# Altium schematic sheet sepic12-12.SchDoc
size A3; Organization: Yandex; Address2: 11 Timura Frunze st., building 2; Release_Date: yyyy-mm-dd; Language: en; Organization2: Self Driving Group LLC
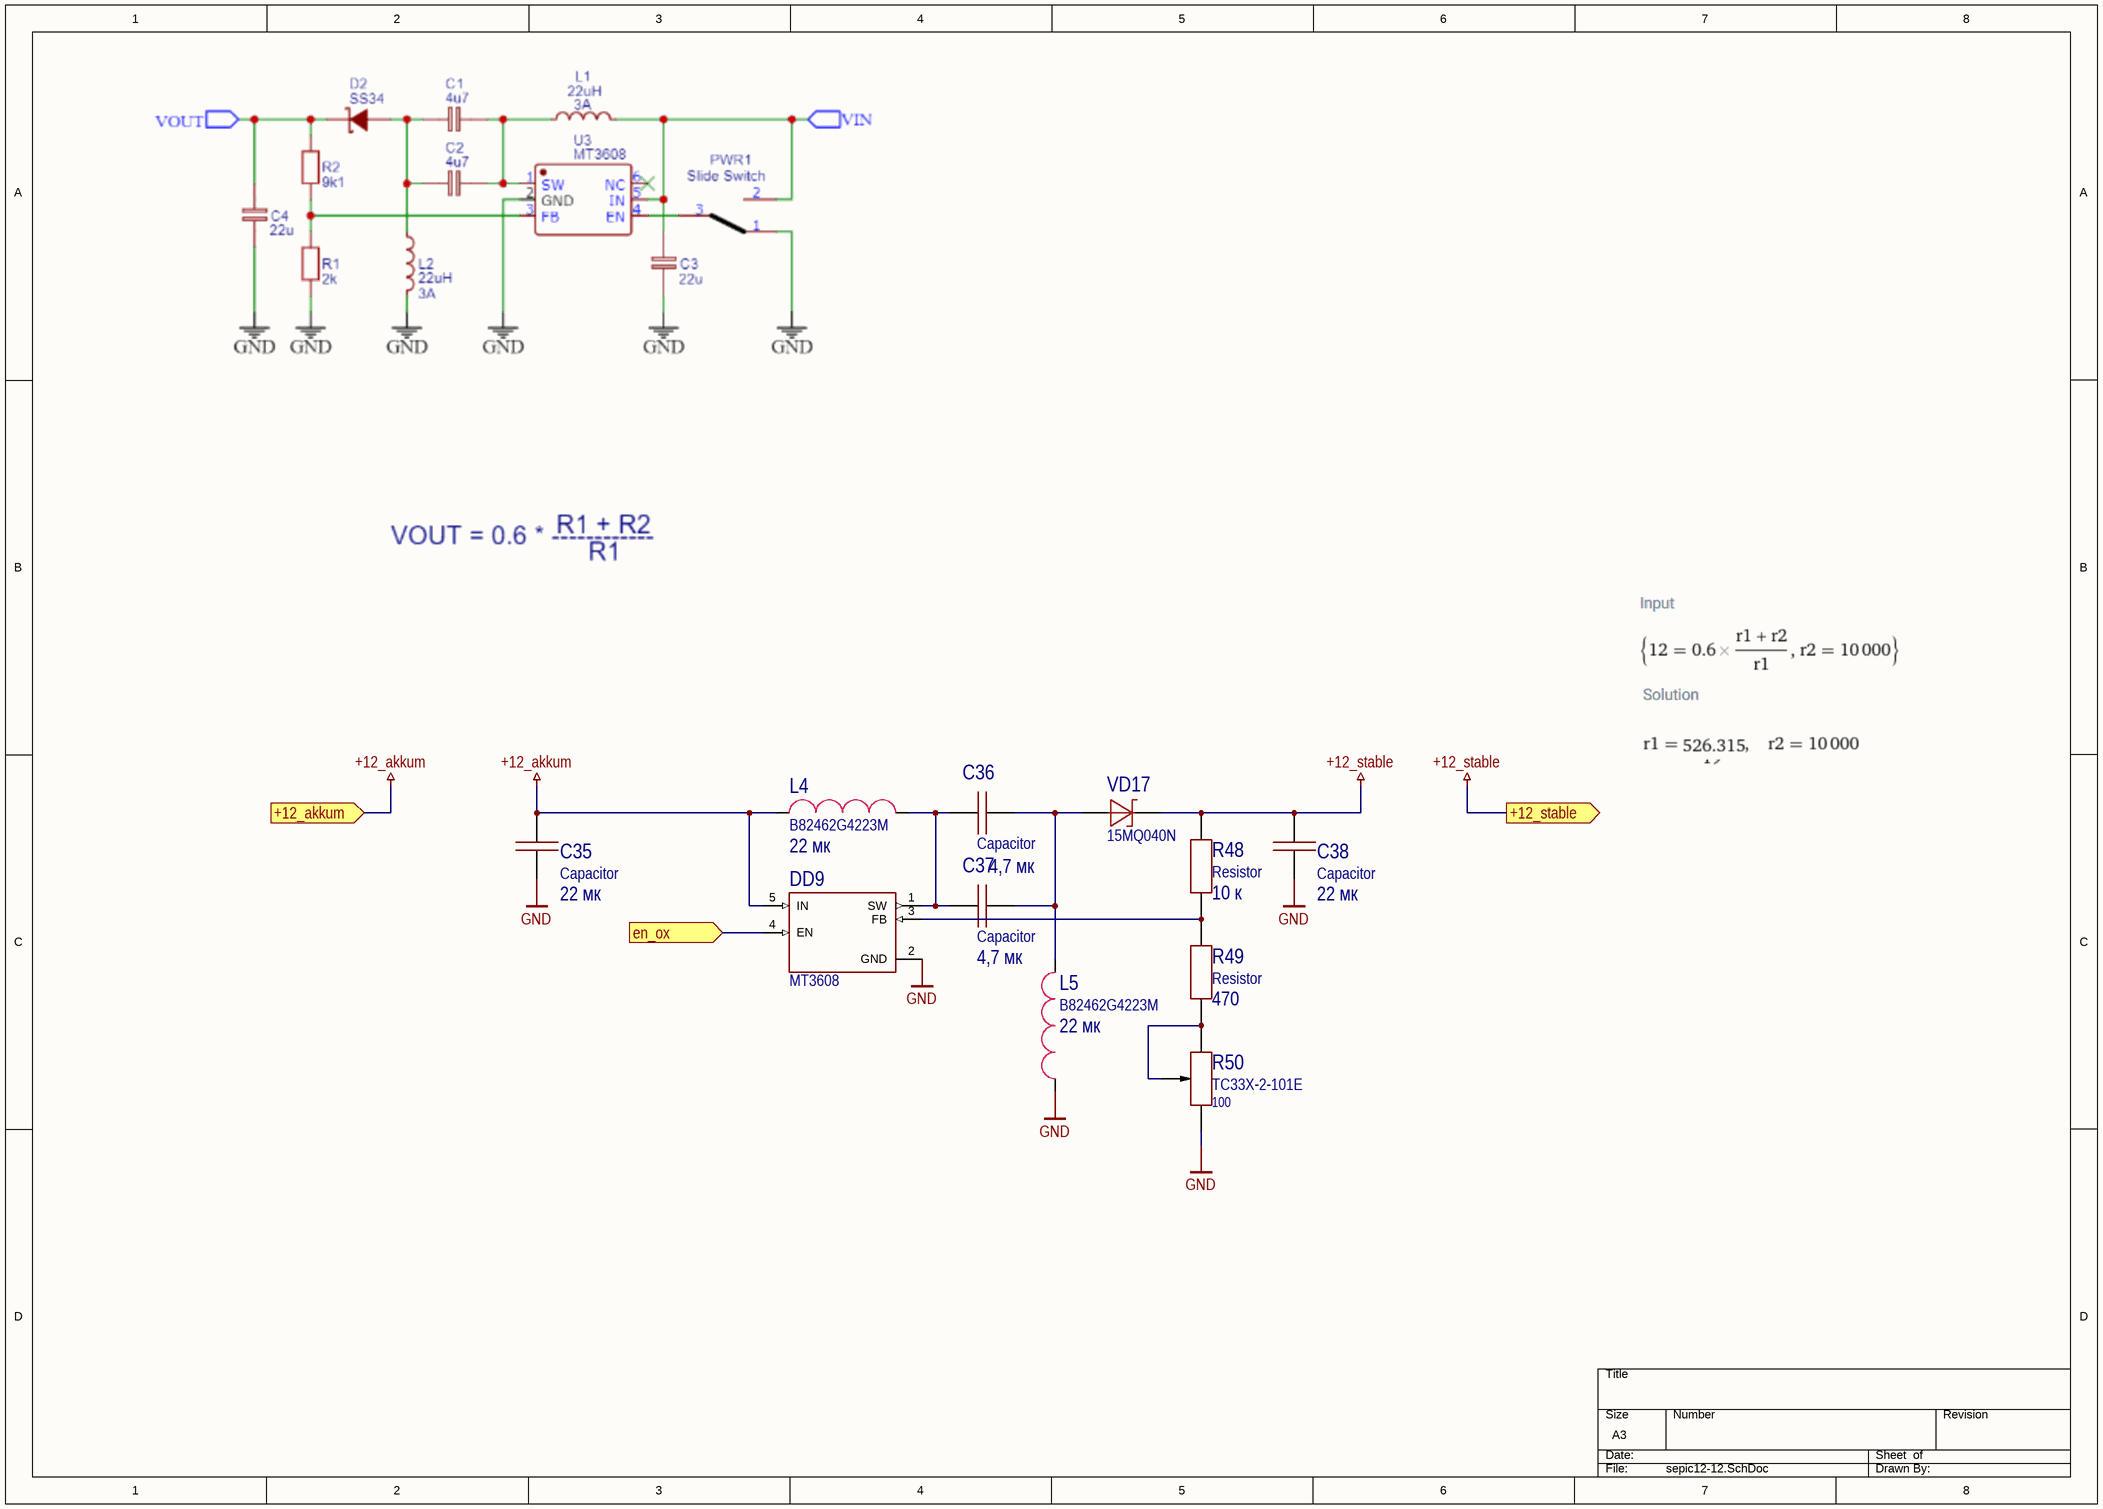
[diagram p0: sepic12-12.SchDoc]

## Parts
C35  Capacitor  value 22 мк  [1210C]
C36  Capacitor  value 4,7 мк  [1206C]
C37  Capacitor  value 4,7 мк  [1206C]
C38  Capacitor  value 22 мк  [1210C]
DD9  MT3608  [SOT23-6]
L4  B82462G4223M  value 22 мк  [B82462G4]
L5  B82462G4223M  value 22 мк  [B82462G4]
R48  Resistor  value 10 к  [0603R]
R49  Resistor  value 470  [0603R]
R50  TC33X-2-101E  value 100  [3mm_trim]
VD17  15MQ040N  [SMA]

## Ports
+12_akkum (in), +12_stable (out), en_ox (in)

## Nets
+12_akkum: C35.2 DD9.5(IN) L4.1 ; port +12_akkum
+12_stable: C38.2 R48.2 VD17.2 ; port +12_stable
GND: C35.1 C38.1 DD9.2(GND) L5.1 R50.1
en_ox: DD9.4(EN) ; port en_ox
NetC36_1: C36.1 C37.1 DD9.1(SW) L4.2
NetC36_2: C36.2 C37.2 L5.2 VD17.1
NetDD9_3: DD9.3(FB) R48.1 R49.2
NetR49_1: R49.1 R50.2 R50.3

## Notes on the sheet
- 1
- 2
- 3
- 4
- 5
- 6
- 7
- 8
- A
- B
- C
- D
- E
- Responsible department
- Technical reference
- Document type
- Document status
- F
- Legal owner
- Created by
- Schematic drawing
- Title, Supplementary title
- CONFIDENTIAL
- Yandex
- Commercial secret
- Self Driving Group LLC
- Approved by
- Doc Rev.
- Date of Issue
- Lang.
- Sheet
- A3

## Library data of the parts
C35 C38 = Capacitor_22u_10_25V_X7R_1210C: Конденсатор; Tolerance: 0,1; Voltage (V): 25; Dielectric: X7R; Capacity (nF): 22000; Part Number: Capacitor_22u_10_25V_X7R_1210C
C36 C37 = Capacitor_4,7u_10_50V_X7R_1206C: Конденсатор; Tolerance: 0,1; Voltage (V): 50; Dielectric: X7R; Capacity (nF): 4700; Part Number: Capacitor_4,7u_10_50V_X7R_1206C
DD9 = MT3608: Повышающий/SEPIC DC-DC преобразователь 2А 1.2МГц; Part Number: MT3608
L4 L5 = B82462G4223M: ЧИП-индуктивность 22мкГн, 1.05A, ±20% катушка; Inductance (μH): 22; Current (A): 1.05; Part Number: B82462G4223M
R48 = Resistor_10k_1_0603: Резистор номиналом 10 кОм и точностью 1%; Power: *; Part Number: Resistor_10k_1_0603; Tolerance: 1%
R49 = Resistor_470_1_0603: Резистор номиналом 470 Ом и точностью 1%; Power: *; Part Number: Resistor_470_1_0603; Tolerance: 1%
R50 = TC33X-2-101E: Потенциометр керметный 100 Ом 0.1Вт для поверхностного монтажа; Tolerance: 50%; Part Number: TC33X-2-101E
VD17 = 15MQ040N: Диод шоттки на 40 В, ном. ток 2.1 А; Voltage nominal (V): 40; Current (A): 2.1; Part Number: 15MQ040N